# Altium schematic sheet Sheet1.SchDoc
size A1; SheetNumber: 1; SheetTotal: 1
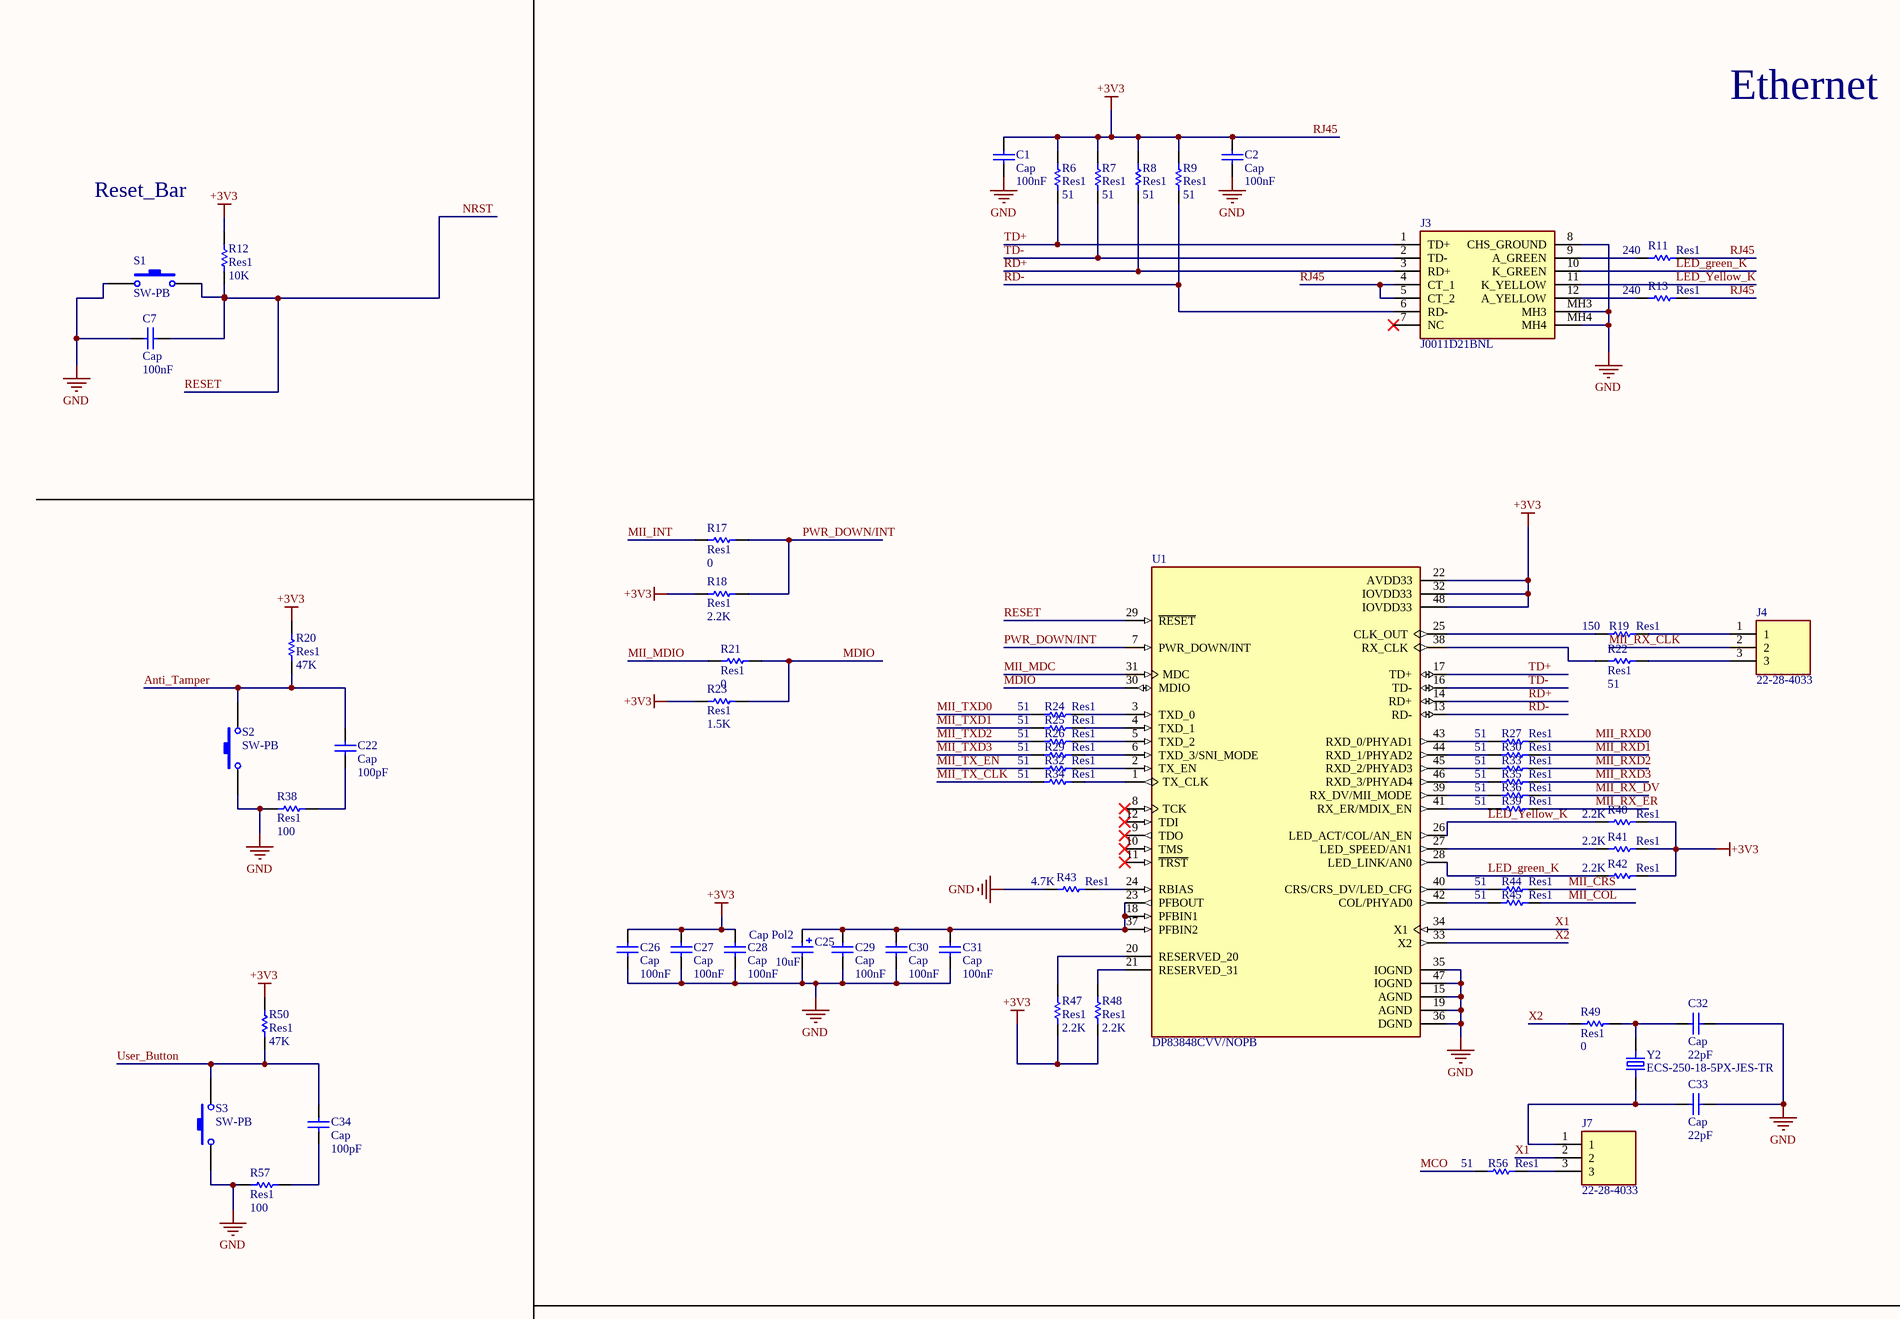
[diagram p0: Sheet1.SchDoc, top left]
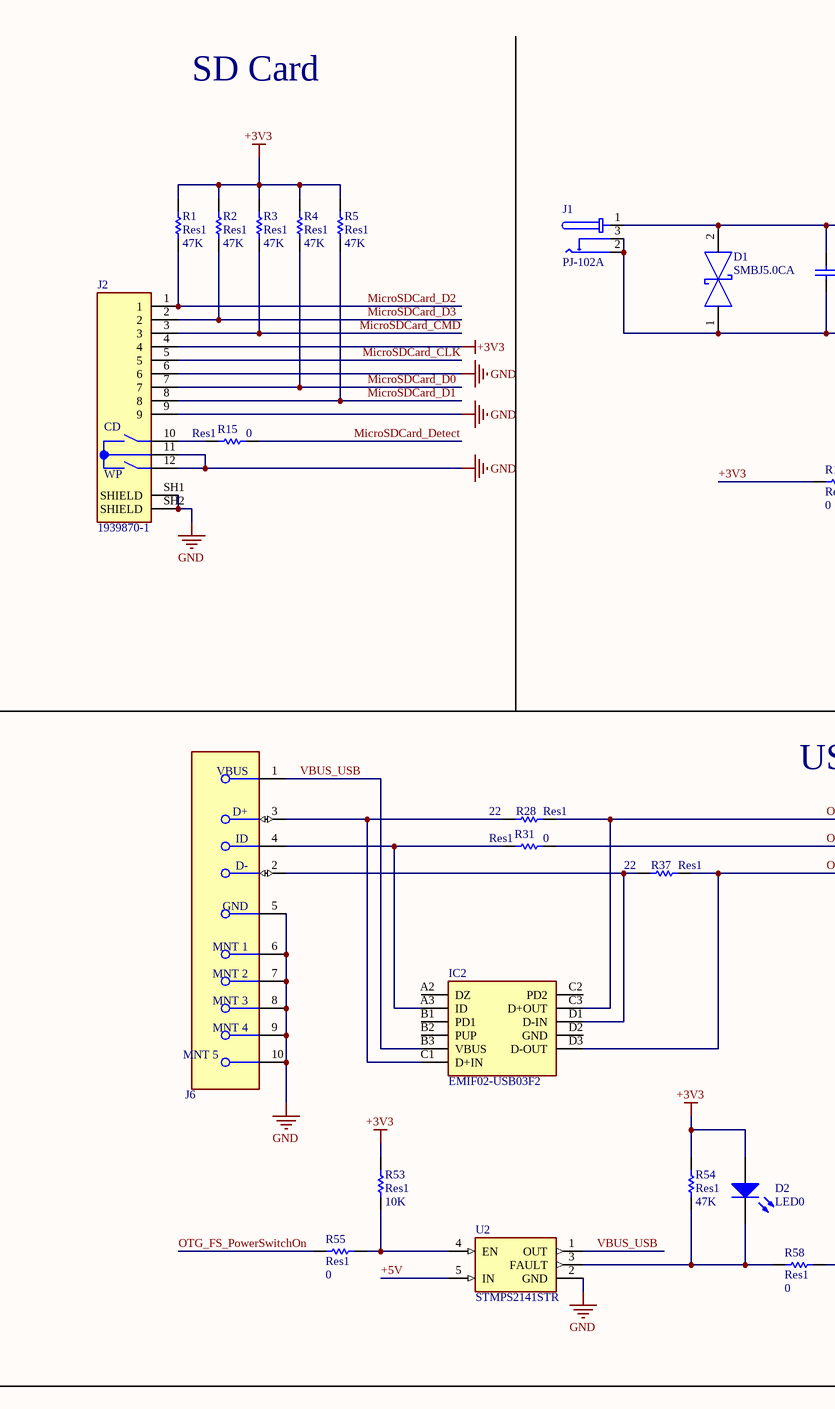
[diagram p1: Sheet1.SchDoc, top middle]
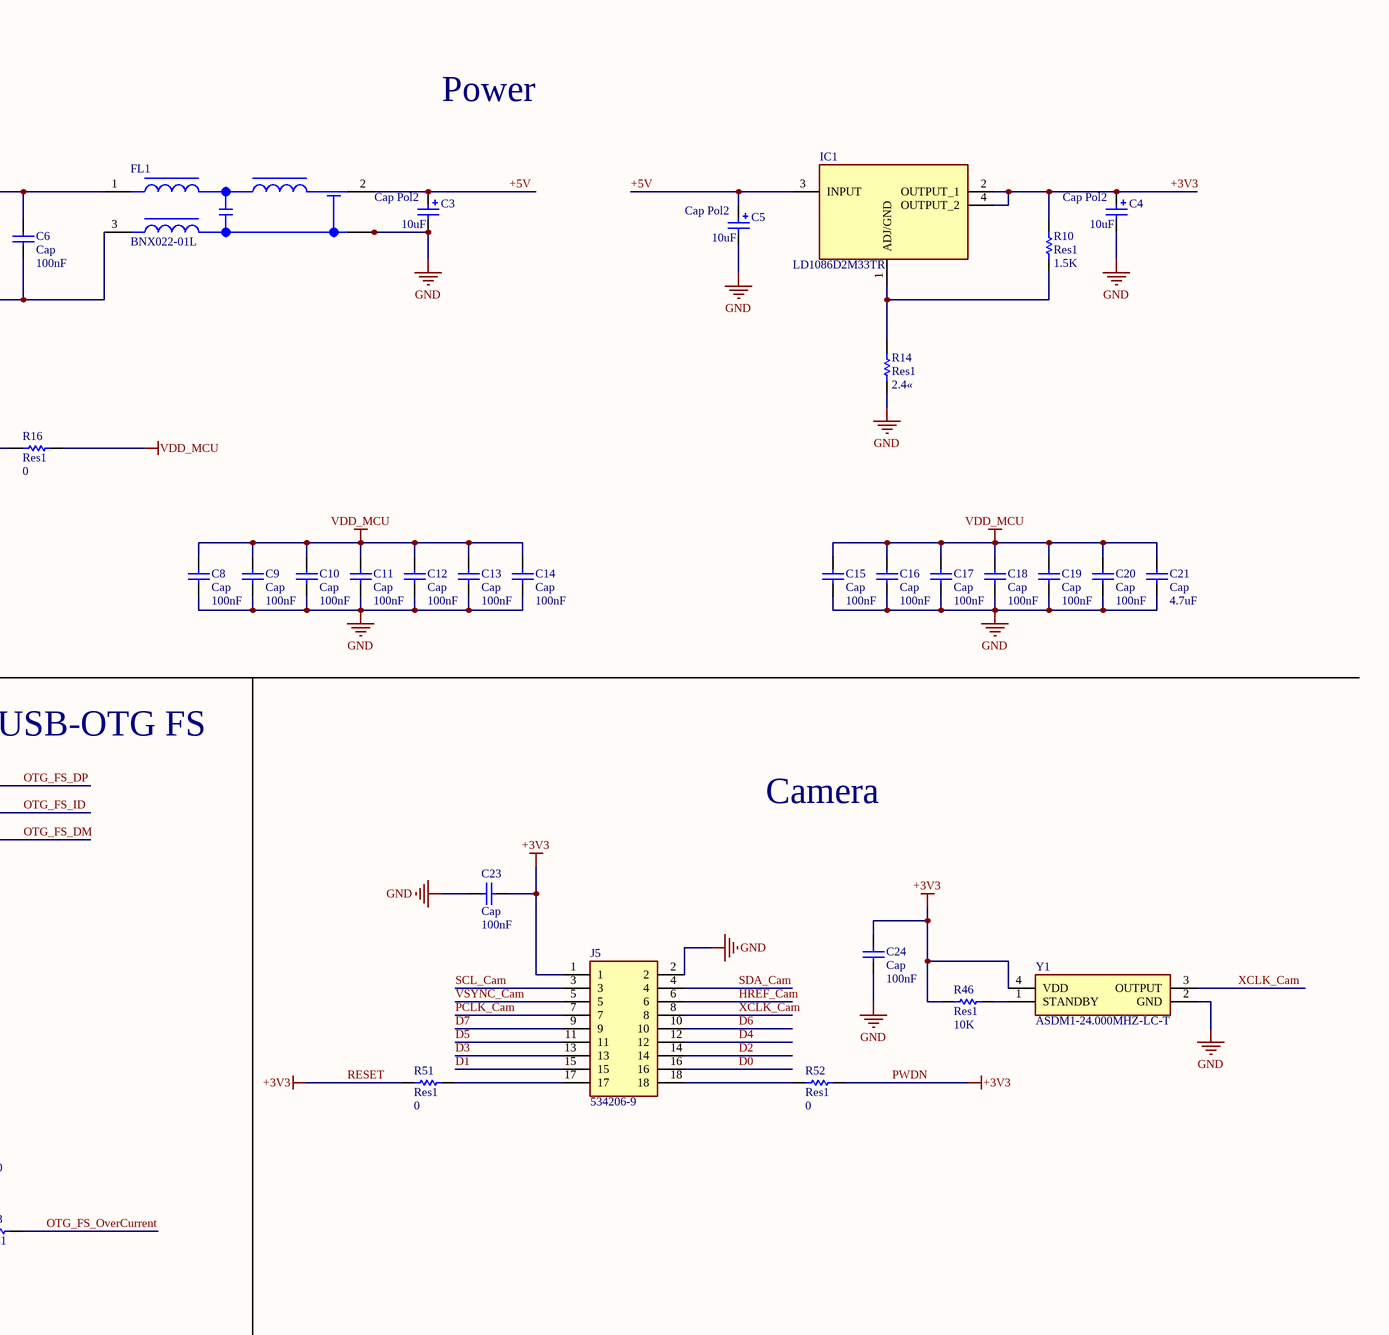
[diagram p2: Sheet1.SchDoc, top right]
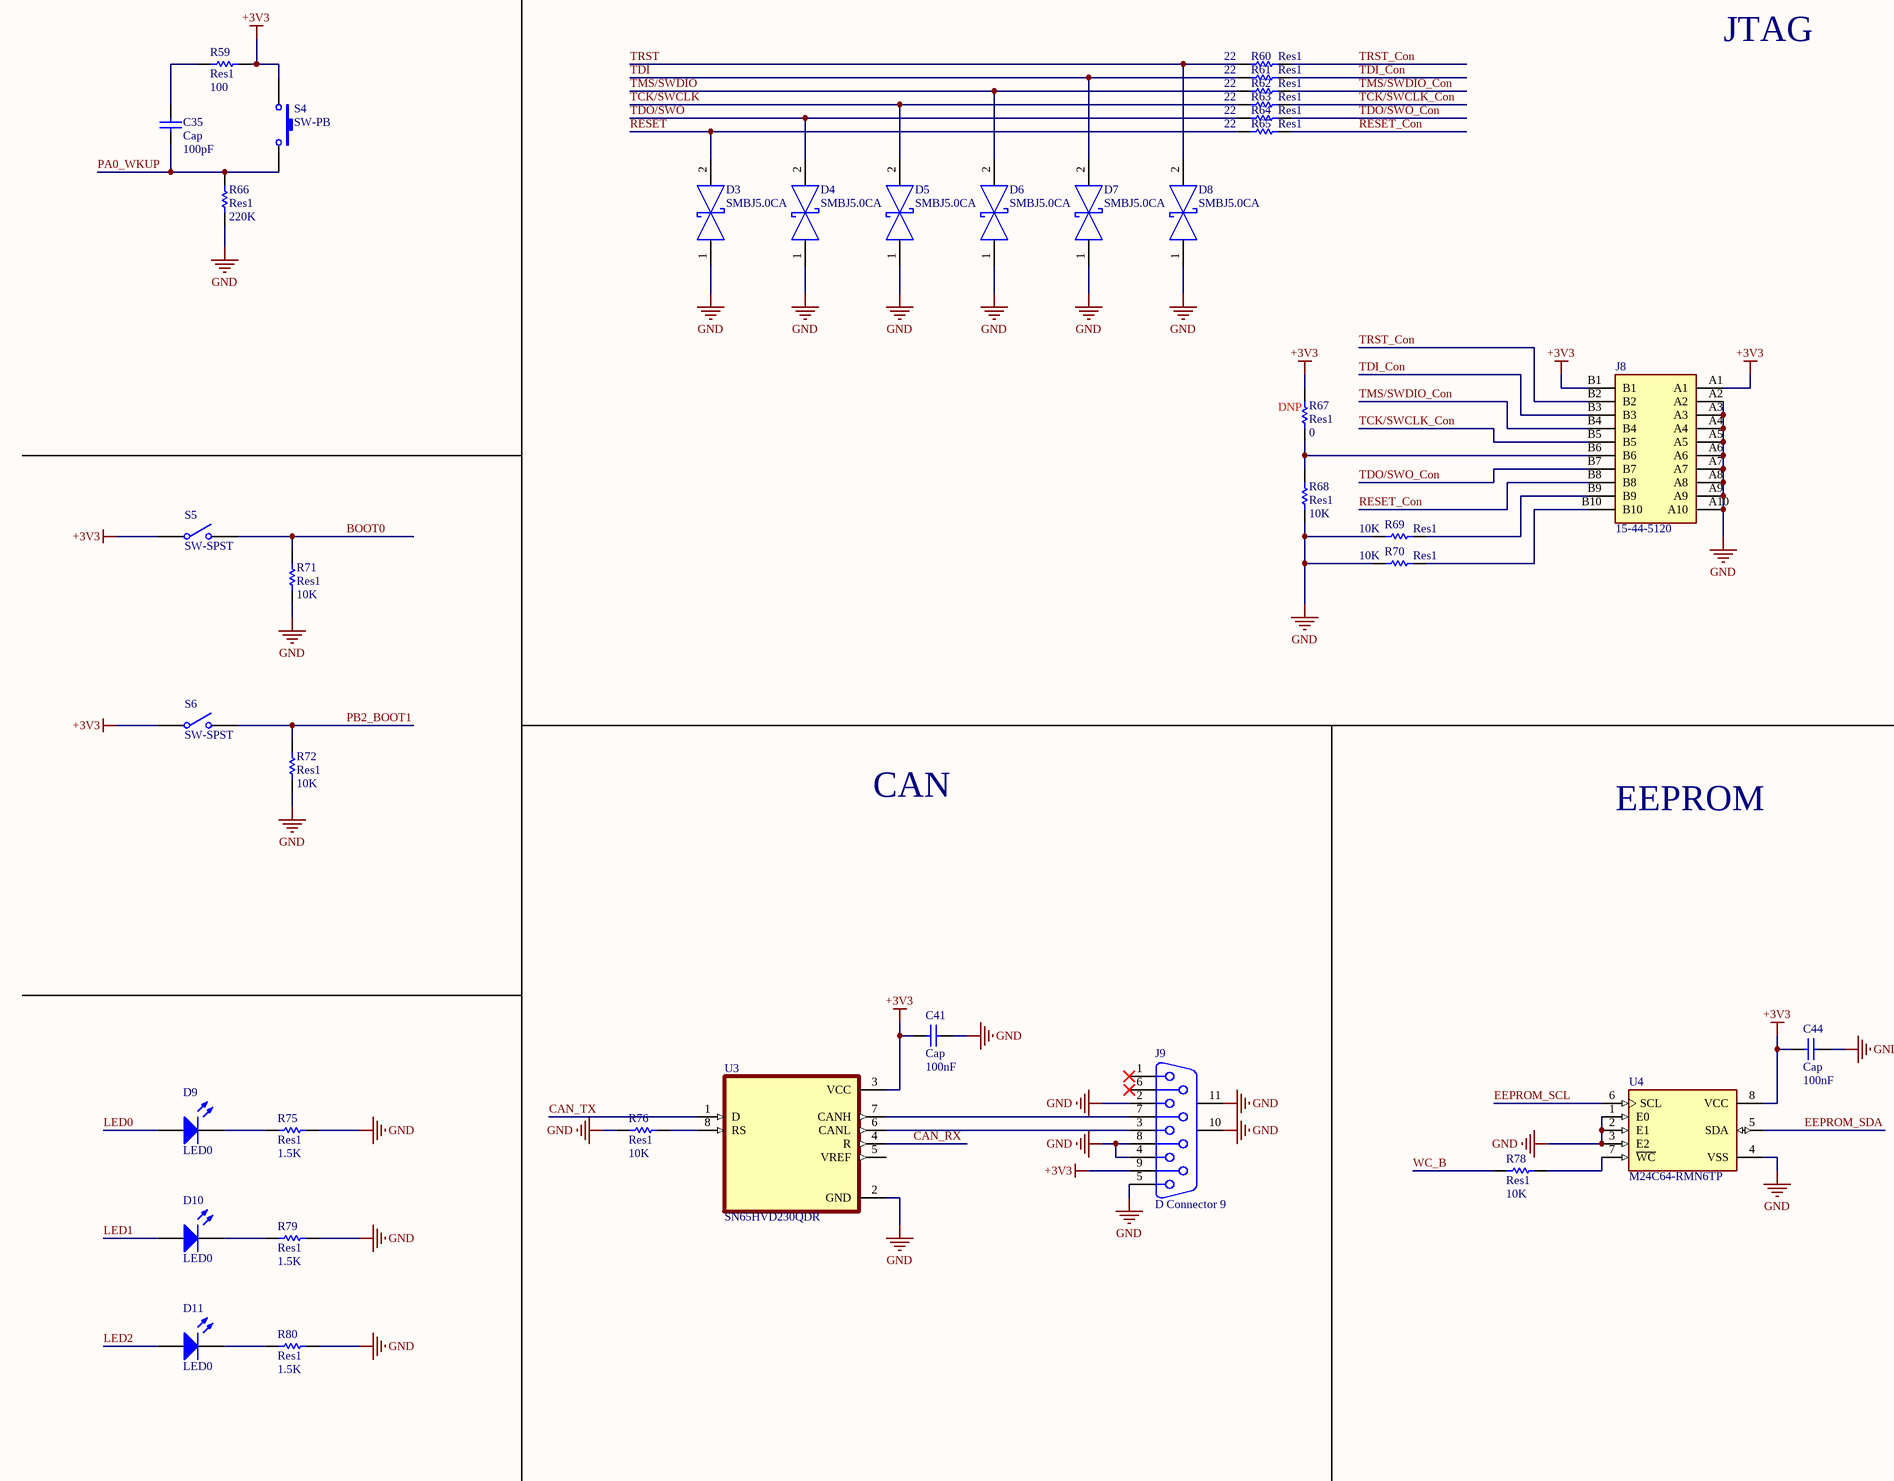
[diagram p3: Sheet1.SchDoc, bottom left]
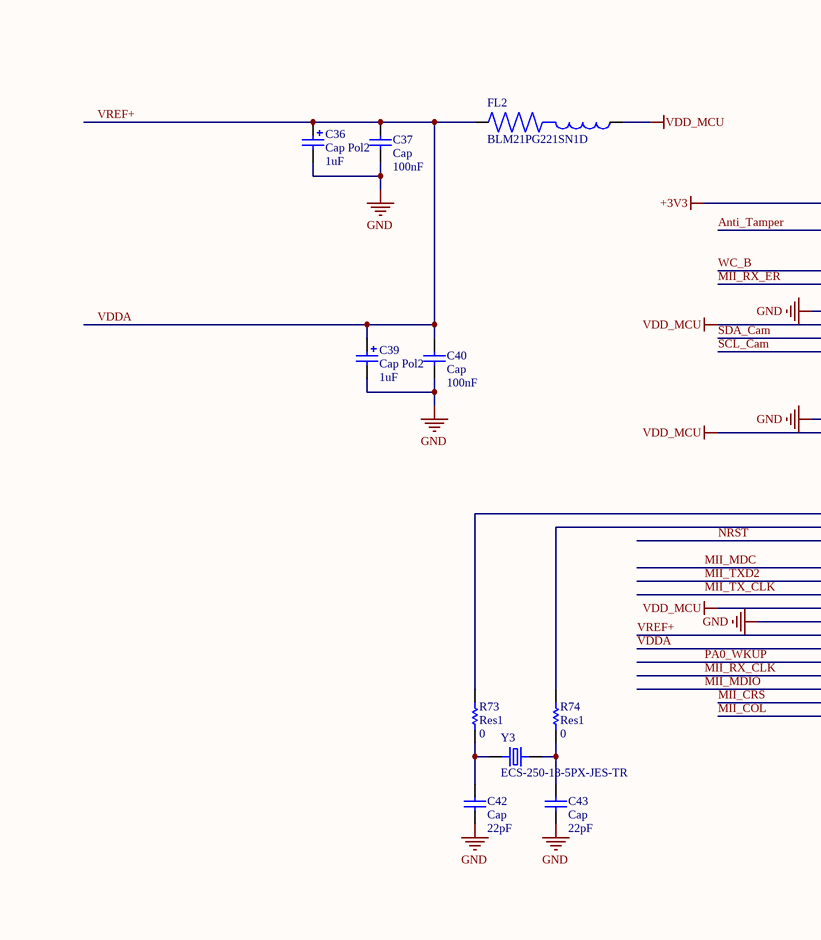
[diagram p4: Sheet1.SchDoc, bottom middle]
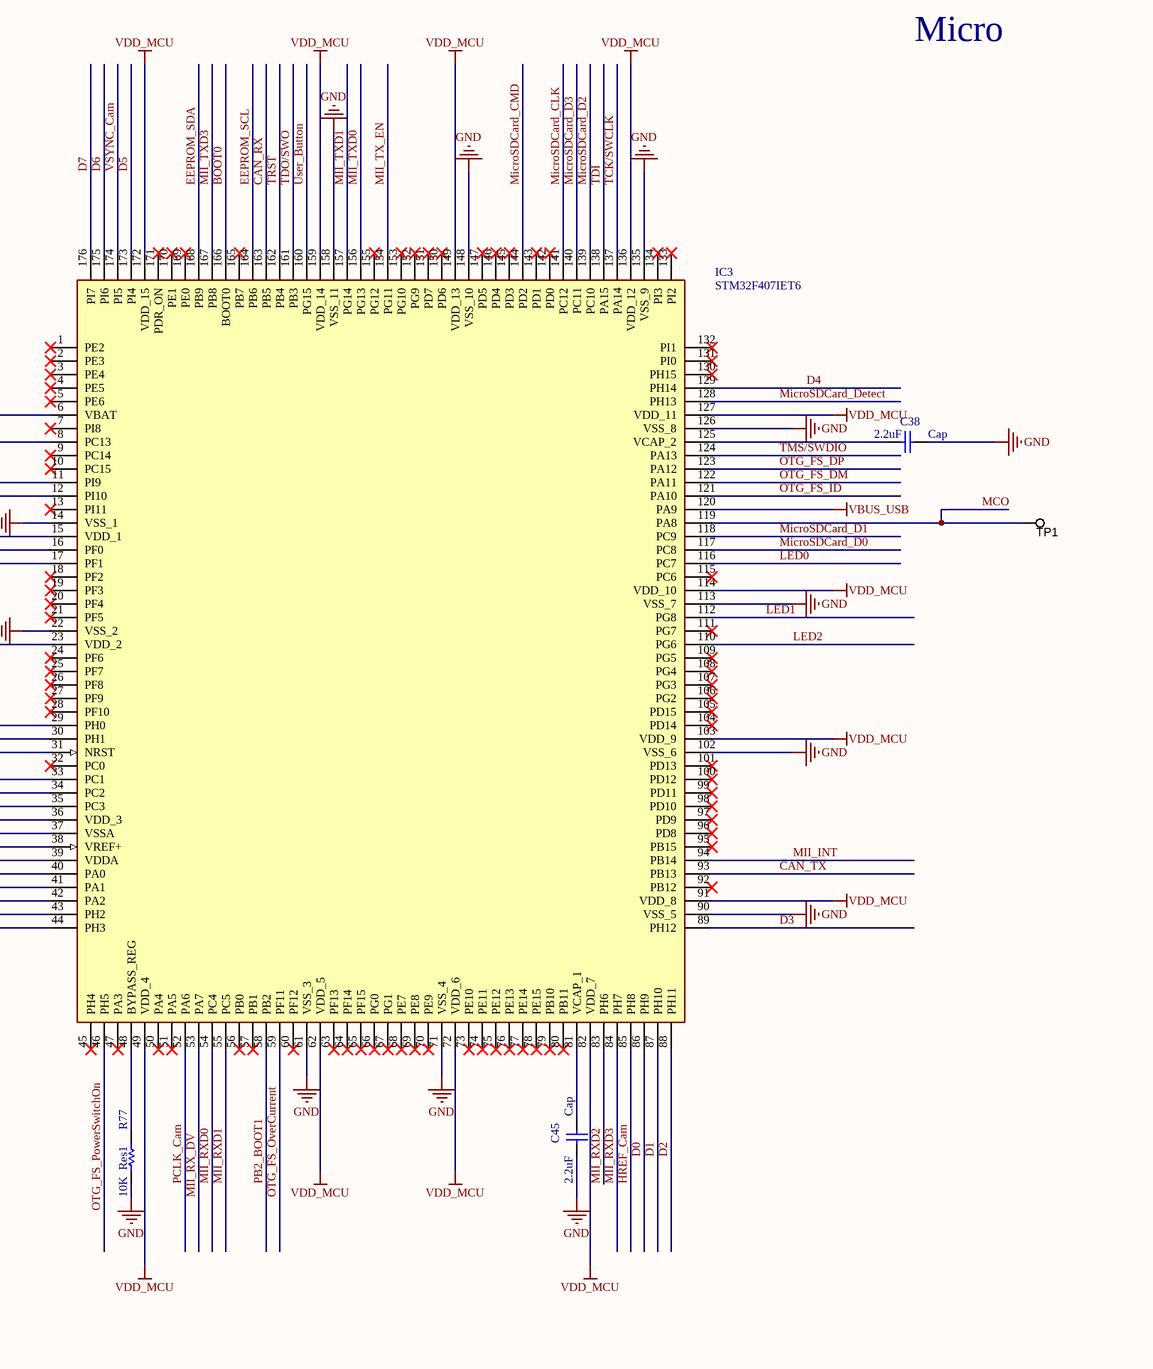
[diagram p5: Sheet1.SchDoc, bottom right]

## Parts
C1  Cap  value 100nF  [SMD_805]
C2  Cap  value 100nF  [SMD_805]
C3  Cap Pol2  value 10uF  [C_B]
C4  Cap Pol2  value 10uF  [C_B]
C5  Cap Pol2  value 10uF  [C_B]
C6  Cap  value 100nF  [SMD_805]
C7  Cap  value 100nF  [SMD_805]
C8  Cap  value 100nF  [SMD_805]
C9  Cap  value 100nF  [SMD_805]
C10  Cap  value 100nF  [SMD_805]
C11  Cap  value 100nF  [SMD_805]
C12  Cap  value 100nF  [SMD_805]
C13  Cap  value 100nF  [SMD_805]
C14  Cap  value 100nF  [SMD_805]
C15  Cap  value 100nF  [SMD_805]
C16  Cap  value 100nF  [SMD_805]
C17  Cap  value 100nF  [SMD_805]
C18  Cap  value 100nF  [SMD_805]
C19  Cap  value 100nF  [SMD_805]
C20  Cap  value 100nF  [SMD_805]
C21  Cap  value 4.7uF  [SMD_805]
C22  Cap  value 100pF  [SMD_805]
C23  Cap  value 100nF  [SMD_805]
C24  Cap  value 100nF  [SMD_805]
C25  Cap Pol2  value 10uF  [C_B]
C26  Cap  value 100nF  [SMD_805]
C27  Cap  value 100nF  [SMD_805]
C28  Cap  value 100nF  [SMD_805]
C29  Cap  value 100nF  [SMD_805]
C30  Cap  value 100nF  [SMD_805]
C31  Cap  value 100nF  [SMD_805]
C32  Cap  value 22pF  [SMD_805]
C33  Cap  value 22pF  [SMD_805]
C34  Cap  value 100pF  [SMD_805]
C35  Cap  value 100pF  [SMD_805]
C36  Cap Pol2  value 1uF  [C_B]
C37  Cap  value 100nF  [SMD_805]
C38  Cap  value 2.2uF  [SMD_805]
C39  Cap Pol2  value 1uF  [C_B]
C40  Cap  value 100nF  [SMD_805]
C41  Cap  value 100nF  [SMD_805]
C42  Cap  value 22pF  [SMD_805]
C43  Cap  value 22pF  [SMD_805]
C44  Cap  value 100nF  [SMD_805]
C45  Cap  value 2.2uF  [SMD_805]
D1  Part Number: SMBJ5.0CA  [Littelfuse_SMBJ5.0CA_0]  (hidden comment: Diode_Littelfuse_SMBJ5.0CA_eec)
D2  LED0  [SMD_805]
D3  Part Number: SMBJ5.0CA  [Littelfuse_SMBJ5.0CA_0]  (hidden comment: Diode_Littelfuse_SMBJ5.0CA_eec)
D4  Part Number: SMBJ5.0CA  [Littelfuse_SMBJ5.0CA_0]  (hidden comment: Diode_Littelfuse_SMBJ5.0CA_eec)
D5  Part Number: SMBJ5.0CA  [Littelfuse_SMBJ5.0CA_0]  (hidden comment: Diode_Littelfuse_SMBJ5.0CA_eec)
D6  Part Number: SMBJ5.0CA  [Littelfuse_SMBJ5.0CA_0]  (hidden comment: Diode_Littelfuse_SMBJ5.0CA_eec)
D7  Part Number: SMBJ5.0CA  [Littelfuse_SMBJ5.0CA_0]  (hidden comment: Diode_Littelfuse_SMBJ5.0CA_eec)
D8  Part Number: SMBJ5.0CA  [Littelfuse_SMBJ5.0CA_0]  (hidden comment: Diode_Littelfuse_SMBJ5.0CA_eec)
D9  LED0  [SMD_805]
D10  LED0  [SMD_805]
D11  LED0  [SMD_805]
FL1  BNX022-01L  [FIL_BNX022-01L]
FL2  BLM21PG221SN1D  [BEADC2012X105N]
IC1  LD1086D2M33TR  [LD1086D2M33TR]
IC2  EMIF02-USB03F2  [BGA11C50P3X4_144X194X72]
IC3  STM32F407IET6  [QFP50P2600X2600X160-176N]
J1  PJ-102A  [CUI_PJ-102A]
J2  1939870-1  [TE_1939870-1]
J3  J0011D21BNL  [J0011D21BNL]
J4  22-28-4033  [HDRV3W66P0X254_1X3_762X249X838P]
J5  534206-9  [5342069]
J6  47590-0001  [Molex_0_MFG]  (value not drawn)
J7  22-28-4033  [HDRV3W66P0X254_1X3_762X249X838P]
J8  15-44-5120  [15445120]
J9  D Connector 9  [COM_3d]
R1  Res1  value 47K  [SMD_805]
R2  Res1  value 47K  [SMD_805]
R3  Res1  value 47K  [SMD_805]
R4  Res1  value 47K  [SMD_805]
R5  Res1  value 47K  [SMD_805]
R6  Res1  value 51  [SMD_805]
R7  Res1  value 51  [SMD_805]
R8  Res1  value 51  [SMD_805]
R9  Res1  value 51  [SMD_805]
R10  Res1  value 1.5K  [SMD_805]
R11  Res1  value 240  [SMD_805]
R12  Res1  value 10K  [SMD_805]
R13  Res1  value 240  [SMD_805]
R14  Res1  value 2.4«  [SMD_805]
R15  Res1  value 0  [SMD_805]
R16  Res1  value 0  [SMD_805]
R17  Res1  value 0  [SMD_805]
R18  Res1  value 2.2K  [SMD_805]
R19  Res1  value 150  [SMD_805]
R20  Res1  value 47K  [SMD_805]
R21  Res1  value 0  [SMD_805]
R22  Res1  value 51  [SMD_805]
R23  Res1  value 1.5K  [SMD_805]
R24  Res1  value 51  [SMD_805]
R25  Res1  value 51  [SMD_805]
R26  Res1  value 51  [SMD_805]
R27  Res1  value 51  [SMD_805]
R28  Res1  value 22  [SMD_805]
R29  Res1  value 51  [SMD_805]
R30  Res1  value 51  [SMD_805]
R31  Res1  value 0  [SMD_805]
R32  Res1  value 51  [SMD_805]
R33  Res1  value 51  [SMD_805]
R34  Res1  value 51  [SMD_805]
R35  Res1  value 51  [SMD_805]
R36  Res1  value 51  [SMD_805]
R37  Res1  value 22  [SMD_805]
R38  Res1  value 100  [SMD_805]
R39  Res1  value 51  [SMD_805]
R40  Res1  value 2.2K  [SMD_805]
R41  Res1  value 2.2K  [SMD_805]
R42  Res1  value 2.2K  [SMD_805]
R43  Res1  value 4.7K  [SMD_805]
R44  Res1  value 51  [SMD_805]
R45  Res1  value 51  [SMD_805]
R46  Res1  value 10K  [SMD_805]
R47  Res1  value 2.2K  [SMD_805]
R48  Res1  value 2.2K  [SMD_805]
R49  Res1  value 0  [SMD_805]
R50  Res1  value 47K  [SMD_805]
R51  Res1  value 0  [SMD_805]
R52  Res1  value 0  [SMD_805]
R53  Res1  value 10K  [SMD_805]
R54  Res1  value 47K  [SMD_805]
R55  Res1  value 0  [SMD_805]
R56  Res1  value 51  [SMD_805]
R57  Res1  value 100  [SMD_805]
R58  Res1  value 0  [SMD_805]
R59  Res1  value 100  [SMD_805]
R60  Res1  value 22  [SMD_805]
R61  Res1  value 22  [SMD_805]
R62  Res1  value 22  [SMD_805]
R63  Res1  value 22  [SMD_805]
R64  Res1  value 22  [SMD_805]
R65  Res1  value 22  [SMD_805]
R66  Res1  value 220K  [SMD_805]
R67  Res1  value 0  [SMD_805]
R68  Res1  value 10K  [SMD_805]
R69  Res1  value 10K  [SMD_805]
R70  Res1  value 10K  [SMD_805]
R71  Res1  value 10K  [SMD_805]
R72  Res1  value 10K  [SMD_805]
R73  Res1  value 0  [SMD_805]
R74  Res1  value 0  [SMD_805]
R75  Res1  value 1.5K  [SMD_805]
R76  Res1  value 10K  [SMD_805]
R77  Res1  value 10K  [SMD_805]
R78  Res1  value 10K  [SMD_805]
R79  Res1  value 1.5K  [SMD_805]
R80  Res1  value 1.5K  [SMD_805]
S1  SW-PB  [RES_B]
S2  SW-PB  [RES_B]
S3  SW-PB  [RES_B]
S4  SW-PB  [RES_B]
S5  SW-SPST  [SPST-2]
S6  SW-SPST  [SPST-2]
TP1  TESTPOINT_PROBE  [TP80D50]  (value not drawn)  (no BOM)
U1  DP83848CVV/NOPB  [QFP50P900X900X160-49N]
U2  STMPS2141STR  [SOT95P280X145-5N]
U3  SN65HVD230QDR  [SOIC127P599X175-8N]
U4  M24C64-RMN6TP  [SOIC127P600X175-8N]
Y1  ASDM1-24.000MHZ-LC-T  [ASDM]
Y2  ECS-250-18-5PX-JES-TR  [XTAL_ECS-250-18-5PX-JES-TR]
Y3  ECS-250-18-5PX-JES-TR  [XTAL_ECS-250-18-5PX-JES-TR]

## Nets
+3V3: C1.2 C2.2 C4.1 C7.1 C23.1 C24.1 C26.2 C27.2 C28.2 C41.2 C44.2 D2.1(A) D3.2 IC1.2(OUTPUT_1) IC1.4(OUTPUT_2) IC3.6(VBAT) IC3.31(NRST) J2.4 J3.4(CT_1) J3.5(CT_2) J5.1 J8.A1 J8.B1 J9.9 R1.1 R2.1 R3.1 R4.1 R5.1 R6.2 R7.2 R8.2 R9.2 R10.2 R11.1 R12.1 R12.2 R13.1 R16.1 R18.1 R20.1 R23.1 R40.1 R41.1 R42.1 R46.2 R47.1 R48.1 R50.1 R51.1 R52.2 R53.2 R54.2 R59.1 R65.1 R67.2 S1.2 S4.1 S5.1(COMMON) S6.1(COMMON) U1.22(AVDD33) U1.29(~{RESET}) U1.32(IOVDD33) U1.48(IOVDD33) U3.3(VCC) U4.8(VCC) Y1.4(VDD)  [also labelled NRST, PWDN, RESET, RJ45]
GND: C1.1 C2.1 C3.2 C4.2 C5.2 C7.2 C8.1 C9.1 C10.1 C11.1 C12.1 C13.1 C14.1 C15.1 C16.1 C17.1 C18.1 C19.1 C20.1 C21.1 C23.2 C24.2 C25.2 C26.1 C27.1 C28.1 C29.1 C30.1 C31.1 C32.2 C33.2 C36.2 C37.1 C38.2 C39.2 C40.1 C41.1 C42.2 C43.2 C44.1 C45.2 D3.1 D4.1 D5.1 D6.1 D7.1 D8.1 FL1.4(CG) FL1.5(CG) FL1.6(CG) IC3.14(VSS_1) IC3.22(VSS_2) IC3.37(VSSA) IC3.61(VSS_3) IC3.71(VSS_4) IC3.90(VSS_5) IC3.102(VSS_6) IC3.113(VSS_7) IC3.126(VSS_8) IC3.135(VSS_9) IC3.148(VSS_10) IC3.158(VSS_11) J2.6 J2.9 J2.11(COMM) J2.12(WP) J2.SH1(SHIELD) J2.SH2(SHIELD) J3.8(CHS_GROUND) J3.MH3 J3.MH4 J5.2 J6.5(GND) J6.6(MNT_1) J6.7(MNT_2) J6.8(MNT_3) J6.9(MNT_4) J6.10(MNT_5) J8.A2 J8.A3 J8.A4 J8.A5 J8.A6 J8.A7 J8.A8 J8.A9 J8.A10 J9.2 J9.4 J9.5 J9.8 J9.10(MH1) J9.11(MH2) R14.1 R38.1 R43.1 R57.1 R66.1 R68.1 R69.1 R70.1 R71.2 R72.2 R75.2 R76.2 R77.2 R79.2 R80.2 S1.1 S2.1 S3.1 U1.15(AGND) U1.19(AGND) U1.35(IOGND) U1.36(DGND) U1.47(IOGND) U2.2(GND) U3.2(GND) U4.1(E0) U4.2(E1) U4.3(E2) U4.4(VSS) Y1.2(GND)
VBUS_USB: IC2.B3(VBUS) IC3.120(PA9) J6.1(VBUS) U2.1(OUT)
VDD_MCU: C8.2 C9.2 C10.2 C11.2 C12.2 C13.2 C14.2 C15.2 C16.2 C17.2 C18.2 C19.2 C20.2 C21.2 FL2.1 IC3.15(VDD_1) IC3.23(VDD_2) IC3.36(VDD_3) IC3.49(VDD_4) IC3.62(VDD_5) IC3.72(VDD_6) IC3.82(VDD_7) IC3.91(VDD_8) IC3.103(VDD_9) IC3.114(VDD_10) IC3.127(VDD_11) IC3.136(VDD_12) IC3.149(VDD_13) IC3.159(VDD_14) IC3.172(VDD_15) R16.2
+5V: C3.1 C5.1 FL1.2(CB) IC1.3(INPUT) U2.5(IN)
Anti_Tamper: C22.1 IC3.8(PC13) R20.2 S2.2
BOOT0: IC3.166(BOOT0) R71.1 S5.2(NO)
CAN_RX: IC3.163(PB5) U3.4(R)
CAN_TX: IC3.93(PB13) U3.1(D)
D0: IC3.86(PH9) J5.16
D1: IC3.87(PH10) J5.15
D2: IC3.88(PH11) J5.14
D3: IC3.89(PH12) J5.13
D4: IC3.129(PH14) J5.12
D5: IC3.173(PI4) J5.11
D6: IC3.175(PI6) J5.10
D7: IC3.176(PI7) J5.9
EEPROM_SCL: IC3.164(PB6) U4.6(SCL)
EEPROM_SDA: IC3.168(PB9) U4.5(SDA)
HREF_Cam: IC3.85(PH8) J5.6
LED0: D9.1(A) IC3.116(PC7)
LED1: D10.1(A) IC3.112(PG8)
LED2: D11.1(A) IC3.110(PG6)
LED_green_K: J3.10(K_GREEN) R42.2 U1.28(LED_LINK/AN0)
LED_Yellow_K: J3.11(K_YELLOW) R40.2 U1.26(LED_ACT/COL/AN_EN)
MCO: IC3.119(PA8) R56.1 TP1.1
MDIO: R21.2 R23.2 U1.30(MDIO)
MicroSDCard_CLK: IC3.141(PC12) J2.5
MicroSDCard_CMD: IC3.144(PD2) J2.3 R3.2
MicroSDCard_D0: IC3.117(PC8) J2.7 R4.2
MicroSDCard_D1: IC3.118(PC9) J2.8 R5.2
MicroSDCard_D2: IC3.139(PC10) J2.1 R1.2
MicroSDCard_D3: IC3.140(PC11) J2.2 R2.2
MicroSDCard_Detect: IC3.128(PH13) R15.2
MII_COL: IC3.44(PH3) R45.2
MII_CRS: IC3.43(PH2) R44.2
MII_INT: IC3.94(PB14) R17.1
MII_MDC: IC3.33(PC1) U1.31(MDC)
MII_MDIO: IC3.42(PA2) R21.1
MII_RX_CLK: IC3.41(PA1) J4.2
MII_RX_DV: IC3.53(PA7) R36.2
MII_RX_ER: IC3.12(PI10) R39.2
MII_RXD0: IC3.54(PC4) R27.2
MII_RXD1: IC3.55(PC5) R30.2
MII_RXD2: IC3.83(PH6) R33.2
MII_RXD3: IC3.84(PH7) R35.2
MII_TX_CLK: IC3.35(PC3) R34.1
MII_TX_EN: IC3.154(PG11) R32.1
MII_TXD0: IC3.156(PG13) R24.1
MII_TXD1: IC3.157(PG14) R25.1
MII_TXD2: IC3.34(PC2) R26.1
MII_TXD3: IC3.167(PB8) R29.1
OTG_FS_DM: IC2.D3(D-OUT) IC3.122(PA11) R37.2
OTG_FS_DP: IC2.C3(D+OUT) IC3.123(PA12) R28.2
OTG_FS_ID: IC3.121(PA10) R31.2
OTG_FS_OverCurrent: IC3.59(PF11) R58.2
OTG_FS_PowerSwitchOn: IC3.46(PH5) R55.1
PA0_WKUP: C35.1 IC3.40(PA0) R66.2 S4.2
PB2_BOOT1: IC3.58(PB2) R72.1 S6.2(NO)
PCLK_Cam: IC3.52(PA6) J5.7
PWR_DOWN/INT: R17.2 R18.2 U1.7(PWR_DOWN/INT)
RD+: J3.3(RD+) R8.1 U1.14(RD+)
RD-: J3.6(RD-) R9.1 U1.13(RD-)
RESET_Con: J8.B8 R65.2
SCL_Cam: IC3.17(PF1) J5.3
SDA_Cam: IC3.16(PF0) J5.4
TCK/SWCLK: D5.2 IC3.137(PA14) R63.1
TCK/SWCLK_Con: J8.B5 R63.2
TD+: J3.1(TD+) R6.1 U1.17(TD+)
TD-: J3.2(TD-) R7.1 U1.16(TD-)
TDI: D7.2 IC3.138(PA15) R61.1
TDI_Con: J8.B3 R61.2
TDO/SWO: D4.2 IC3.161(PB3) R64.1
TDO/SWO_Con: J8.B7 R64.2
TMS/SWDIO: D6.2 IC3.124(PA13) R62.1
TMS/SWDIO_Con: J8.B4 R62.2
TRST: D8.2 IC3.162(PB4) R60.1
TRST_Con: J8.B2 R60.2
User_Button: C34.1 IC3.160(PG15) R50.2 S3.2
VDDA: C36.1 C37.2 C39.1 C40.2 FL2.2 IC3.38(VREF+) IC3.39(VDDA)  [also labelled VREF+]
VSYNC_Cam: IC3.174(PI5) J5.5
WC_B: IC3.11(PI9) R78.1
X1: J7.2 U1.34(X1)
X2: R49.1 U1.33(X2)
XCLK_Cam: J5.8 Y1.3(OUTPUT)
NetC6_1: C6.1 D1.2 FL1.1(B) J1.1
NetC6_2: C6.2 D1.1 FL1.3(PSG) J1.2 J1.3
NetC22_2: C22.2 R38.2
NetC25_1: C25.1 C29.2 C30.2 C31.2 U1.18(PFBIN1) U1.23(PFBOUT) U1.37(PFBIN2)
NetC32_1: C32.1 R49.2 Y2.2
NetC33_1: C33.1 J7.1 Y2.1
NetC34_2: C34.2 R57.2
NetC35_2: C35.2 R59.2
NetC38_1: C38.1 IC3.125(VCAP_2)
NetC42_1: C42.1 R73.2 Y3.2
NetC43_1: C43.1 R74.2 Y3.1
NetC45_1: C45.1 IC3.81(VCAP_1)
NetD2_2: D2.2(K) R54.1 R58.1 U2.3(FAULT)
NetD9_2: D9.2(K) R75.1
NetD10_2: D10.2(K) R79.1
NetD11_2: D11.2(K) R80.1
NetIC1_1: IC1.1(ADJ/GND) R10.1 R14.2
NetIC2_A3: IC2.A3(ID) J6.4(ID) R31.1
NetIC2_C1: IC2.C1(D+IN) J6.3(D+) R28.1
NetIC2_D1: IC2.D1(D-IN) J6.2(D-) R37.1
NetIC3_29: IC3.29(PH0) R73.1
NetIC3_30: IC3.30(PH1) R74.1
NetIC3_48: IC3.48(BYPASS_REG) R77.1
NetJ2_10: J2.10(CD) R15.1
NetJ3_9: J3.9(A_GREEN) R11.2
NetJ3_12: J3.12(A_YELLOW) R13.2
NetJ4_1: J4.1 R19.2
NetJ4_3: J4.3 R22.1
NetJ5_17: J5.17 R51.2
NetJ5_18: J5.18 R52.1
NetJ7_3: J7.3 R56.2
NetJ8_B6: J8.B6 R67.1 R68.2
NetJ8_B9: J8.B9 R69.2
NetJ8_B10: J8.B10 R70.2
NetJ9_3: J9.3 U3.6(CANL)
NetJ9_7: J9.7 U3.7(CANH)
NetR19_1: R19.1 U1.25(CLK_OUT)
NetR22_2: R22.2 U1.38(RX_CLK)
NetR24_2: R24.2 U1.3(TXD_0)
NetR25_2: R25.2 U1.4(TXD_1)
NetR26_2: R26.2 U1.5(TXD_2)
NetR27_1: R27.1 U1.43(RXD_0/PHYAD1)
NetR29_2: R29.2 U1.6(TXD_3/SNI_MODE)
NetR30_1: R30.1 U1.44(RXD_1/PHYAD2)
NetR32_2: R32.2 U1.2(TX_EN)
NetR33_1: R33.1 U1.45(RXD_2/PHYAD3)
NetR34_2: R34.2 U1.1(TX_CLK)
NetR35_1: R35.1 U1.46(RXD_3/PHYAD4)
NetR36_1: R36.1 U1.39(RX_DV/MII_MODE)
NetR39_1: R39.1 U1.41(RX_ER/MDIX_EN)
NetR41_2: R41.2 U1.27(LED_SPEED/AN1)
NetR43_2: R43.2 U1.24(RBIAS)
NetR44_1: R44.1 U1.40(CRS/CRS_DV/LED_CFG)
NetR45_1: R45.1 U1.42(COL/PHYAD0)
NetR46_1: R46.1 Y1.1(STANDBY)
NetR47_2: R47.2 U1.20(RESERVED_20)
NetR48_2: R48.2 U1.21(RESERVED_31)
NetR53_1: R53.1 R55.2 U2.4(EN)
NetR76_1: R76.1 U3.8(RS)
NetR78_2: R78.2 U4.7(~{WC})

Not connected (* = marked no-connect by the designer): IC2 A2(DZ) B1(PD1) B2(PUP) C2(PD2) D2(GND); IC3 1(PE2)* 2(PE3)* 3(PE4)* 4(PE5)* 5(PE6)* 7(PI8)* 9(PC14)* 10(PC15)* 13(PI11)* 18(PF2)* 19(PF3)* 20(PF4)* 21(PF5)* 24(PF6)* 25(PF7)* 26(PF8)* 27(PF9)* 28(PF10)* 32(PC0)* 45(PH4)* 47(PA3)* 50(PA4)* 51(PA5)* 56(PB0)* 57(PB1)* 60(PF12)* 63(PF13)* 64(PF14)* 65(PF15)* 66(PG0)* 67(PG1)* 68(PE7)* 69(PE8)* 70(PE9)* 73(PE10)* 74(PE11)* 75(PE12)* 76(PE13)* 77(PE14)* 78(PE15)* 79(PB10)* 80(PB11)* 92(PB12)* 95(PB15)* 96(PD8)* 97(PD9)* 98(PD10)* 99(PD11)* 100(PD12)* 101(PD13)* 104(PD14)* 105(PD15)* 106(PG2)* 107(PG3)* 108(PG4)* 109(PG5)* 111(PG7)* 115(PC6)* 130(PH15)* 131(PI0)* 132(PI1)* 133(PI2)* 134(PI3)* 142(PD0)* 143(PD1)* 145(PD3)* 146(PD4)* 147(PD5)* 150(PD6)* 151(PD7)* 152(PG9)* 153(PG10)* 155(PG12)* 165(PB7)* 169(PE0)* 170(PE1)* 171(PDR_ON)*; J3 7(NC)*; J9 1* 6*; U1 8(TCK)* 9(TDO)* 10(TMS)* 11(~{TRST})* 12(TDI)*; U3 5(VREF)

## Notes on the sheet
- SD Card
- Ethernet
- Power
- Reset_Bar
- USB-OTG FS
- Camera
- JTAG
- Micro
- (near R67) DNP
- CAN
- EEPROM

## Library data of the parts
C1 C2 C6-C20 C23 C24 C26-C31 C37 C38 C40 C41 C44 C45 = Cap_1: Capacitor; Published: 8-Jun-2000; LatestRevisionDate: 17-Jul-2002; LatestRevisionNote: Re-released for DXP Platform.; PackageReference: RAD-0.3; Publisher: Altium Limited; PackageDescription: Radial Cap, Thru-Hole; 2 Leads; 0.3 in Pin Spacing
C3-C5 C25 = Cap Pol2_1: Polarized Capacitor (Axial); Published: 8-Jun-2000; LatestRevisionDate: 17-Jul-2002; LatestRevisionNote: Re-released for DXP Platform.; PackageReference: POLAR0.8; Publisher: Altium Limited; PackageDescription: Polarized Capacitor; 2 Leads
C21 = Cap_2: Capacitor; Published: 8-Jun-2000; LatestRevisionDate: 17-Jul-2002; LatestRevisionNote: Re-released for DXP Platform.; PackageReference: RAD-0.3; Publisher: Altium Limited; PackageDescription: Radial Cap, Thru-Hole; 2 Leads; 0.3 in Pin Spacing
C22 C34 C35 = Cap: Capacitor; Published: 8-Jun-2000; LatestRevisionDate: 17-Jul-2002; LatestRevisionNote: Re-released for DXP Platform.; PackageReference: RAD-0.3; Publisher: Altium Limited; PackageDescription: Radial Cap, Thru-Hole; 2 Leads; 0.3 in Pin Spacing
C32 C33 C42 C43 = Cap_3: Capacitor; Published: 8-Jun-2000; LatestRevisionDate: 17-Jul-2002; LatestRevisionNote: Re-released for DXP Platform.; PackageReference: RAD-0.3; Publisher: Altium Limited; PackageDescription: Radial Cap, Thru-Hole; 2 Leads; 0.3 in Pin Spacing
C36 C39 = Cap Pol2: Polarized Capacitor (Axial); Published: 8-Jun-2000; LatestRevisionDate: 17-Jul-2002; LatestRevisionNote: Re-released for DXP Platform.; PackageReference: POLAR0.8; Publisher: Altium Limited; PackageDescription: Polarized Capacitor; 2 Leads
D1 D3-D8 = Diode_Littelfuse_SMBJ5.0CA_eec: DIODE TVS DIODE 5VWM 9.2VC DO214AA; helpURL: https://upverter.com/upn/revision/8728899143034b73/; ComponentLink2Description: Datasheet; Temperature: -55°C to +150°C; Package: DO214AA; Supplier 2: Mouser; Price: 0.281709217619; Supplier 1: Digi-Key; ComponentLink1URL: https://upverter.com/upn/revision/8728899143034b73/; Supplier Part Number 2: 652-SMBJ5.0CA; Supplier Part Number 1: SMBJ5.0CABCT-ND; Manufacturer: Littelfuse; ComponentLink1Description: Upverter; ComponentLink2URL: http://www.littelfuse.com/~/media/electronics/datasheets/tvs_diodes/littelfuse_tvs_diode_smbj_datasheet.pdf.pdf; RoHS: TRUE; Mouser Part Number: 652-SMBJ5.0CA; Temperature Range High: +150°C; Digikey Description: DIODE TVS DIODE 5VWM 9.2VC DO214AA; Digikey Part Number: SMBJ5.0CABCT-ND; Lead Free: yes; Temperature Range Low: -55°C
D2 D9-D11 = LED0: Typical INFRARED GaAs LED; Published: 8-Jun-2000; LatestRevisionDate: 08-Jul-2005; LatestRevisionNote: Mech Layer 1 removed.; PackageReference: LED-0; Publisher: Altium Limited; PackageDescription: LED; 2 Leads
FL1 = BNX022-01L: LC EMI Filter 5th Order Low Pass 2 Channel C = 1ÂµF 20A 4-SMD, No Lead; MF: Murata; Availability: Good; Purchase-URL: https://pricing.snapeda.com/search/part/BNX022-01L/?ref=eda; SnapEDA_Link: https://www.snapeda.com/parts/BNX022-01L/Murata/view-part/4300438/?ref=snap; Price: None; Check_prices: https://www.snapeda.com/parts/BNX022-01L/Murata/view-part/4300438/?ref=eda; Package: SMD-4 Murata; MP: BNX022-01L; Value: *
FL2 = BLM21PG221SN1D: FERRITE BEAD, 0805 CASE, 220OHM; Inductor Type:Ferrite Bead; Series:BLM21; Resistance:0.05ohm; DC Current Max:2000mA; Case Style:0805; Core Material:Ferrite; Temp, Op. Max:+125Â°C; Temp, Op. Min:-55Â°C; Typ Impedance @ 100MHz:220ohm; Package: None; Price: None; Availability: Unavailable; MP: BLM21PG221SN1D; Value: *
IC1 = LD1086D2M33TR: Integrated Circuit; Manufacturer_Name: STMicroelectronics; Datasheet Link: http://www.st.com/web/en/resource/technical/document/datasheet/CD00001884.pdf; Height: 4.6mm; Manufacturer_Part_Number: LD1086D2M33TR; Mouser Part Number: 511-LD1086D2M33-TR; Mouser Price/Stock: https://www.mouser.co.uk/ProductDetail/STMicroelectronics/LD1086D2M33TR?qs=I99Cha7Up6QLBH2pissvdA%3D%3D; Arrow Part Number: LD1086D2M33TR; Arrow Price/Stock: https://www.arrow.com/en/products/ld1086d2m33tr/stmicroelectronics?region=nac
IC2 = EMIF02-USB03F2: Integrated Circuit; Manufacturer_Name: STMicroelectronics; Datasheet Link: http://www.st.com/content/ccc/resource/technical/document/datasheet/0a/25/37/a6/28/ab/4f/24/CD00042880.pdf/files/CD00042880.pdf/jcr:content/translations/en.CD00042880.pdf; Height: 0.715mm; Manufacturer_Part_Number: EMIF02-USB03F2; Mouser Part Number: 511-EMIF02-USB03F2; Mouser Price/Stock: https://www.mouser.co.uk/ProductDetail/STMicroelectronics/EMIF02-USB03F2?qs=8SLFIzuTIIpj%252BMnUWjyx7Q%3D%3D; Arrow Part Number: EMIF02-USB03F2; Arrow Price/Stock: https://www.arrow.com/en/products/emif02-usb03f2/stmicroelectronics?region=nac
IC3 = STM32F407IET6: Integrated Circuit; Manufacturer_Name: STMicroelectronics; Datasheet Link: http://www.st.com/web/en/resource/technical/document/datasheet/DM00037051.pdf; Height: 1.6mm; Manufacturer_Part_Number: STM32F407IET6; Mouser Part Number: 511-STM32F407IET6; Mouser Price/Stock: https://www.mouser.co.uk/ProductDetail/STMicroelectronics/STM32F407IET6?qs=Z8%252BeY1k3TIJwlXfelATEbg%3D%3D; Arrow Part Number: STM32F407IET6; Arrow Price/Stock: https://www.arrow.com/en/products/stm32f407iet6/stmicroelectronics?region=europe
J1 = PJ-102A: 2.0 x 6.5 mm, 2.5 A, Horizontal, Through Hole, Tapered Pins, Dc Power Jack Connector; MF: Same Sky; SnapEDA_Link: https://www.snapeda.com/parts/PJ-102A/Same+Sky/view-part/?ref=snap; Package: None; Value: *; MP: PJ-102A; Check_prices: https://www.snapeda.com/parts/PJ-102A/Same+Sky/view-part/?ref=eda
J3 = J0011D21BNL: Connector; Manufacturer_Name: Pulse Electronics; Datasheet Link: https://www.mouser.de/datasheet/2/336/J403-370307.pdf; Height: 16.39mm; Manufacturer_Part_Number: J0011D21BNL; Mouser Part Number: 673-J0011D21BNL; Mouser Price/Stock: https://www.mouser.co.uk/ProductDetail/Pulse-Electronics/J0011D21BNL?qs=9%2F6FFzrkRD68%2FMKMj9hCQA%3D%3D; Arrow Part Number: J0011D21BNL; Arrow Price/Stock: https://www.arrow.com/en/products/j0011d21bnl/pulse-electronics-corporation?utm_currency=USD&region=nac
J4 J7 = 22-28-4033: MOLEX - 22-28-4033 - CONNECTOR, HEADER, 3POS, 1ROW, 2.54MM; Geometry.Height: 8.38mm; Manufacturer_Name: Molex; Manufacturer_Part_Number: 22-28-4033; Mouser Part Number: 538-22-28-4033; Mouser Price/Stock: https://www.mouser.co.uk/ProductDetail/Molex/22-28-4033?qs=d9fIA1aNikRRpuevshfBIQ%3D%3D; Arrow Part Number: *; Arrow Price/Stock: *; Datasheet Link: https://www.molex.com/pdm_docs/sd/022284033_sd.pdf
J5 = 534206-9: Connector; Manufacturer_Name: TE Connectivity; Datasheet Link: https://datasheet.datasheetarchive.com/originals/distributors/Datasheets_SAMA/d5e45df42a2111fe15cf5cf0bb0b250c.pdf; Height: 8.77mm; Manufacturer_Part_Number: 534206-9; Mouser Part Number: 571-5342069; Mouser Price/Stock: https://www.mouser.co.uk/ProductDetail/TE-Connectivity/534206-9?qs=ZDXmSm1359220DEa7nt8XA%3D%3D; Arrow Part Number: 534206-9; Arrow Price/Stock: https://www.arrow.com/en/products/534206-9/te-connectivity
J8 = 15-44-5120: Connector; Manufacturer_Name: Molex; Datasheet Link: https://www.molex.com/pdm_docs/sd/015445120_sd.pdf; Height: 8.77mm; Manufacturer_Part_Number: 15-44-5120; Mouser Part Number: 538-15-44-5120; Mouser Price/Stock: https://www.mouser.co.uk/ProductDetail/Molex/15-44-5120?qs=iMhni6YwqGhbypKC9uI4zw%3D%3D
J9 = D Connector 9: Receptacle Assembly, 9 Position, Right Angle; PackageDocument: O; Positions: 9; Published: 15-Jun-2001; LatestRevisionDate: 17-Jul-2002; LatestRevisionNote: Re-released for DXP Platform.; DatasheetDocument: 1-Sep-1999; PackageReference: 788750; Publisher: Altium Limited; Orientation: Right Angle; Gender: Receptacle
R1-R9 R11 R13 R15-R42 R44 R45 R47-R52 R55-R67 R73 R74 = Res1_4: Resistor; Published: 8-Jun-2000; LatestRevisionDate: 17-Jul-2002; LatestRevisionNote: Re-released for DXP Platform.; PackageReference: AXIAL-0.3; Publisher: Altium Limited; PackageDescription: Axial Device, Thru-Hole; 2 Leads; 0.3 in Pin Spacing
R10 R14 R75 R79 R80 = Res1_8: Resistor; Published: 8-Jun-2000; LatestRevisionDate: 17-Jul-2002; LatestRevisionNote: Re-released for DXP Platform.; PackageReference: AXIAL-0.3; Publisher: Altium Limited; PackageDescription: Axial Device, Thru-Hole; 2 Leads; 0.3 in Pin Spacing
R12 R46 R53 R54 R68-R72 R76-R78 = Res1_6: Resistor; Published: 8-Jun-2000; LatestRevisionDate: 17-Jul-2002; LatestRevisionNote: Re-released for DXP Platform.; PackageReference: AXIAL-0.3; Publisher: Altium Limited; PackageDescription: Axial Device, Thru-Hole; 2 Leads; 0.3 in Pin Spacing
R43 = Res1_5: Resistor; Published: 8-Jun-2000; LatestRevisionDate: 17-Jul-2002; LatestRevisionNote: Re-released for DXP Platform.; PackageReference: AXIAL-0.3; Publisher: Altium Limited; PackageDescription: Axial Device, Thru-Hole; 2 Leads; 0.3 in Pin Spacing
S1-S4 = SW-PB: Switch; Published: 24-Mar-1999; LatestRevisionDate: 17-Jul-2002; LatestRevisionNote: Re-released for DXP Platform.; PackageReference: SPST-2; Publisher: Altium Limited; PackageDescription: Switch; 2 Leads
S5 S6 = SW-SPST: Single-Pole, Single-Throw Switch; Published: 24-Mar-1999; LatestRevisionDate: 17-Jul-2002; LatestRevisionNote: Re-released for DXP Platform.; PackageReference: SPST-2; Publisher: Altium Limited; PackageDescription: Switch; 2 Leads
TP1 = TESTPOINT_PROBE: TEST POINT; MANF: MANF; MANF_P#: MANF_P#; VALUE: VALUE
U1 = DP83848CVV/NOPB: 1/1 Transceiver - Ethernet 48-LQFP (7x7); MF: Texas Instruments; SnapEDA_Link: https://www.snapeda.com/parts/DP83848CVV/Texas+Instruments/view-part/?ref=snap; Package: LQFP-48 Texas Instruments; Value: *; MP: DP83848CVV; Check_prices: https://www.snapeda.com/parts/DP83848CVV/Texas+Instruments/view-part/?ref=eda
U2 = STMPS2141STR: Power Switch/Driver 1:1 N-Channel 500mA SOT-23-5; MF: STMicroelectronics; MP: STMPS2141STR; Package: SOT-23 STMicroelectronics; Purchase-URL: https://pricing.snapeda.com/search/part/STMPS2141STR/?ref=eda; Check_prices: https://www.snapeda.com/parts/STMPS2141STR/STMicroelectronics/view-part/?ref=eda; Value: *; Digi-Key_Part_Number: 497-6933-2-ND; SnapEDA_Link: https://www.snapeda.com/parts/STMPS2141STR/STMicroelectronics/view-part/?ref=snap
U3 = SN65HVD230QDR: 3.3-V CAN Transceiver with Standby Mode 8-SOIC -40 to 125; MF: Texas Instruments; Package: SOIC-8 Texas Instruments; Price: None; MP: SN65HVD230QDR; Availability: Good; Value: *; Check_prices: https://www.snapeda.com/parts/SN65HVD230QDR/Texas%20Instruments/view-part/1178075/?ref=eda; Purchase-URL: https://pricing.snapeda.com/search/part/SN65HVD230QDR/?ref=eda; SnapEDA_Link: https://www.snapeda.com/parts/SN65HVD230QDR/Texas%20Instruments/view-part/1178075/?ref=snap
U4 = M24C64-RMN6TP: EEPROM Serial-I2C 64K-bit 8K x 8 2.5V/3.3V/5V 8-Pin SOIC T/R; MP: altium_native_batch; Price: None; Value: *; Package: None; Availability: Unavailable
Y1 = ASDM1-24.000MHZ-LC-T: Crystal or Oscillator; Manufacturer_Name: ABRACON; Datasheet Link: https://abracon.com/Oscillators/ASDM.pdf; Height: 0.9mm; Manufacturer_Part_Number: ASDM1-24.000MHZ-LC-T; Mouser Part Number: 815-ASDM1-24.0-LCT; Mouser Price/Stock: https://www.mouser.com/Search/Refine.aspx?Keyword=815-ASDM1-24.0-LCT
Y2 Y3 = ECS-250-18-5PX-JES-TR: 25MHz Â±20ppm Crystal 18pF 30 Ohms HC-49/US; MF: ECS Inc.; SnapEDA_Link: https://www.snapeda.com/parts/ECS-250-18-5PX-JES-TR/ECS%20Inc./view-part/3661493/?ref=snap; MP: ECS-250-18-5PX-JES-TR; Availability: Good; Price: None; Check_prices: https://www.snapeda.com/parts/ECS-250-18-5PX-JES-TR/ECS%20Inc./view-part/3661493/?ref=eda; Value: *; Purchase-URL: https://pricing.snapeda.com/search/part/ECS-250-18-5PX-JES-TR/?ref=eda; Package: HC49/US ECS International
J2 = 1939870-1: Package: None; Price: None; Value: *; MP: 1939870-1; Availability: Unavailable